# EAGLE schematic Timer_CMD (EAGLE 7.0.0)
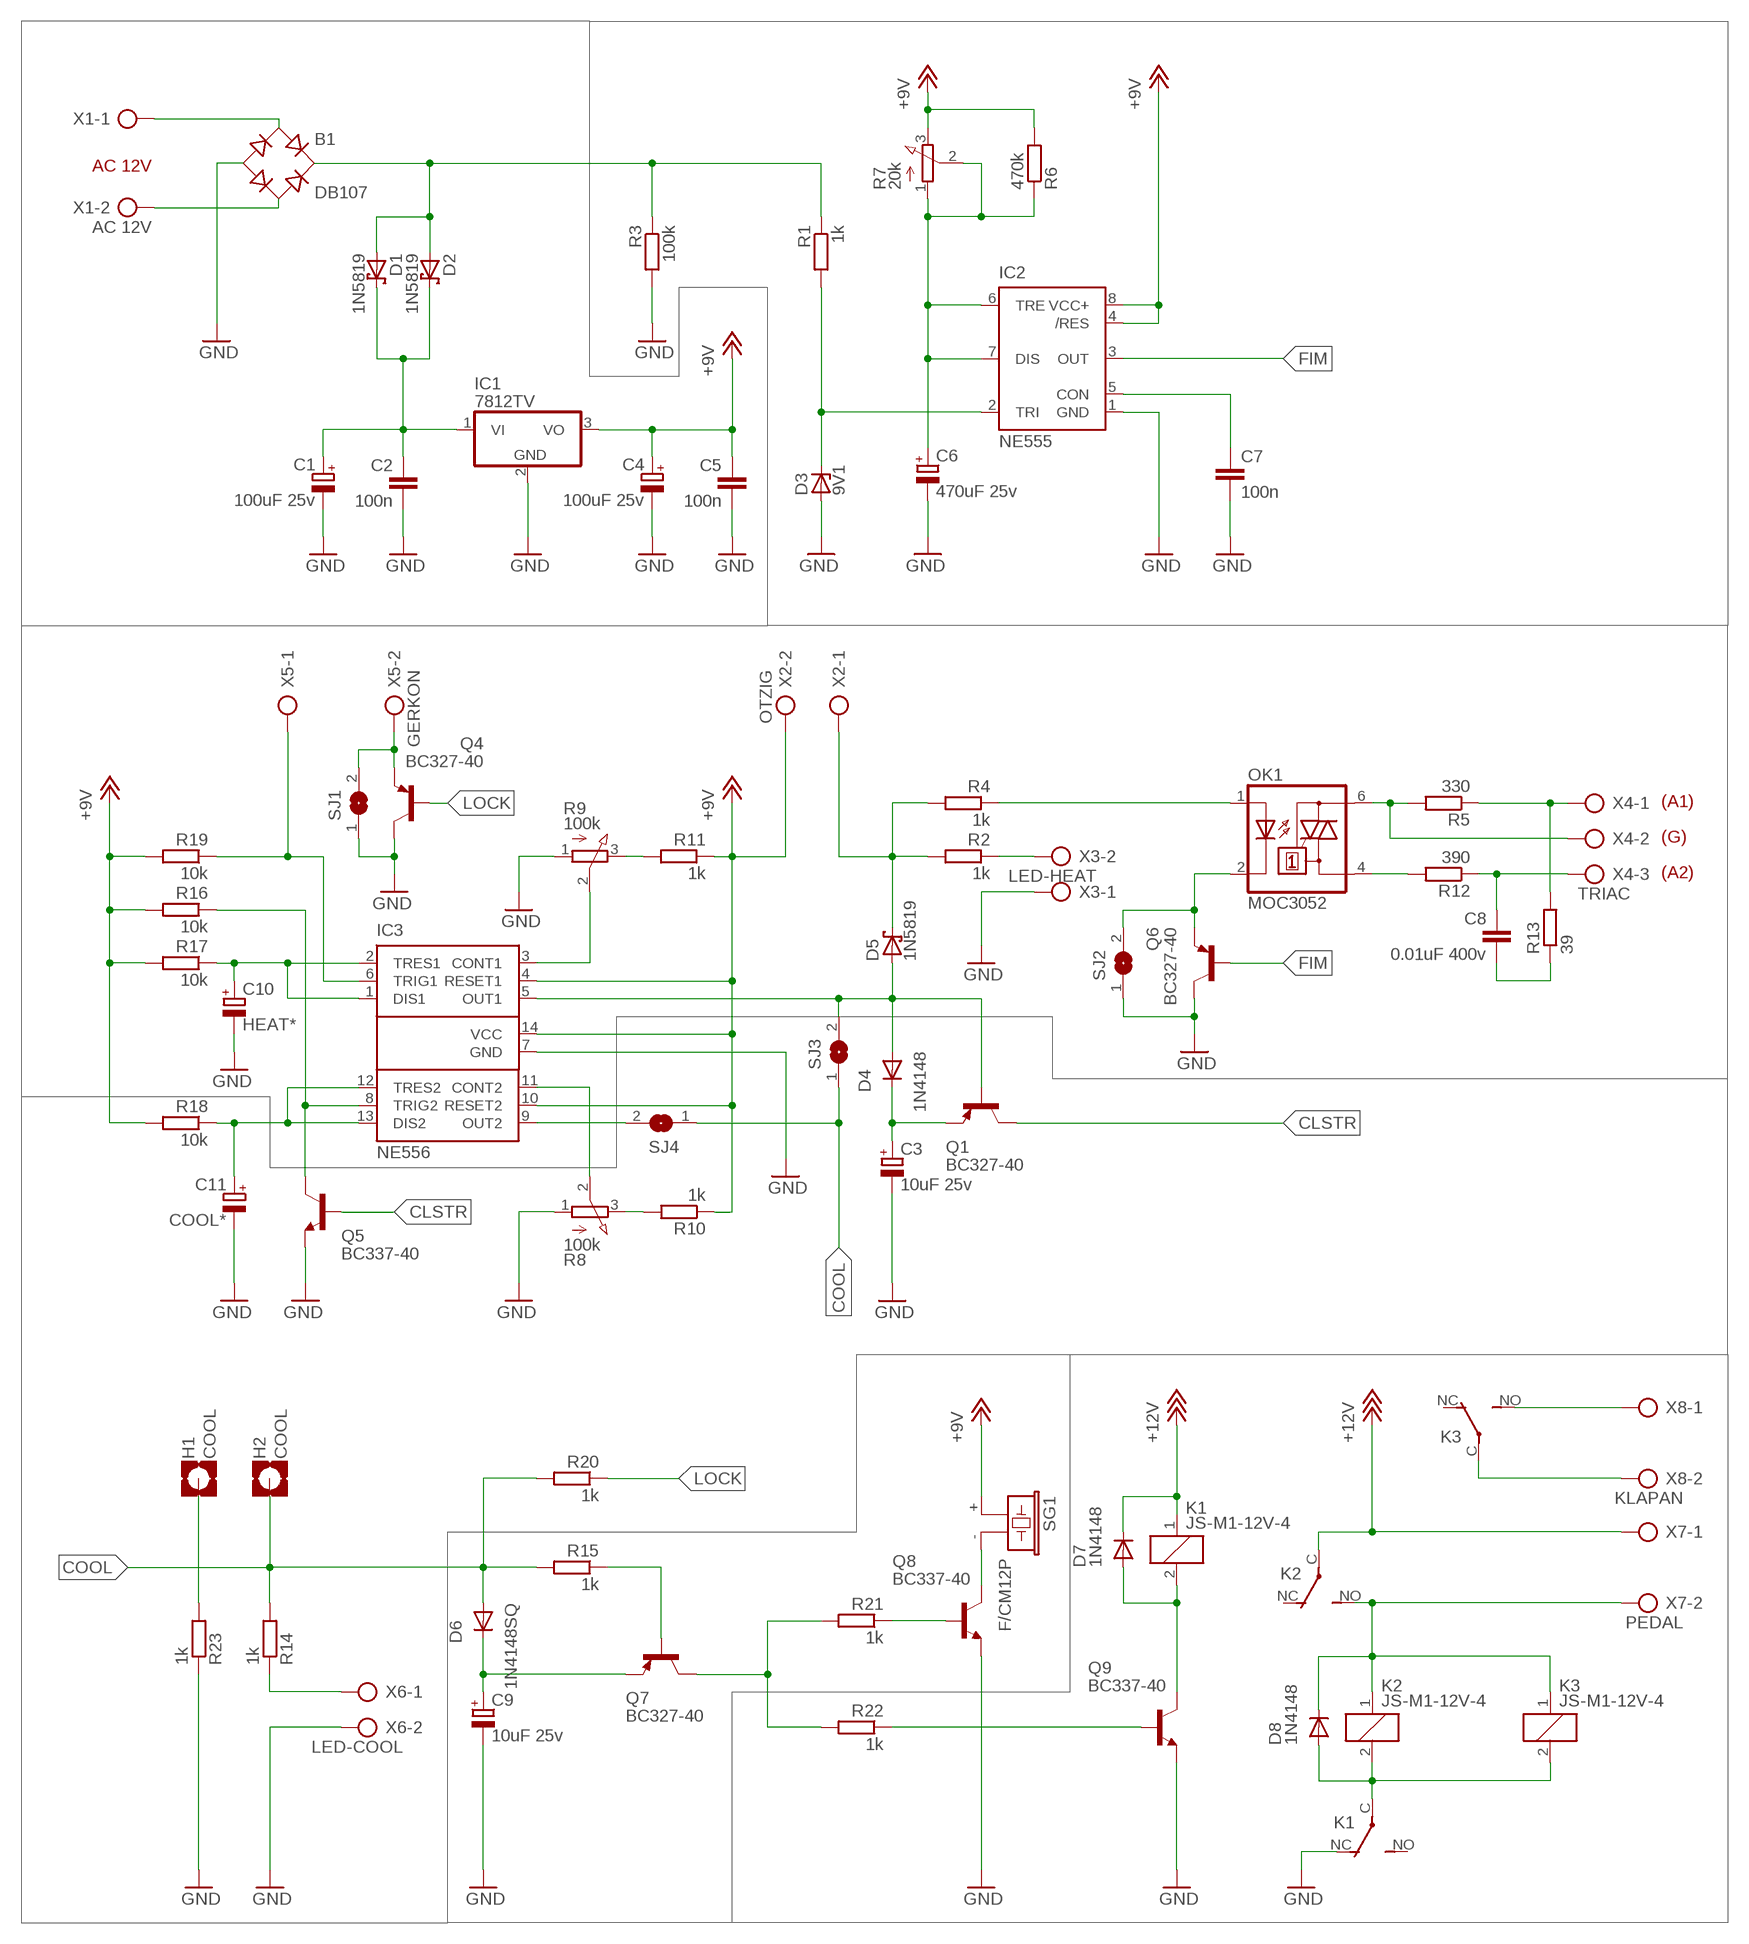
[diagram p0: schematic, sheet 1]

## Parts
B1  DB107  DBDB107G  [DB]
C1  100uF 25v  CPOL-EUE3.5-8  [E3,5-8]
C2  100n  C-EU025-030X050  [C025-030X050]
C3  10uF 25v  CPOL-EUE3.5-8  [E3,5-8]
C4  100uF 25v  CPOL-EUE3.5-8  [E3,5-8]
C5  100n  C-EU025-030X050  [C025-030X050]
C6  470uF 25v  CPOL-EUE3.5-8  [E3,5-8]
C7  100n  C-EU050-035X075  [C050-035X075]
C8  0.01uF 400v  C-EU075-063X106  [C075-063X106]
C9  10uF 25v  CPOL-EUE3.5-8  [E3,5-8]
C10  HEAT*  CPOL-EUE3.5-10  [E3,5-10]
C11  COOL*  CPOL-EUE3.5-10  [E3,5-10]
D1  1N5819  1N5819-T  [DO41-7.6]
D2  1N5819  1N5819-T  [DO41-7.6]
D3  9V1  1N4728  [DO41Z10]
D4  1N4148  1N4148S  [DO35-7SQ]
D5  1N5819  1N5819-T  [DO41-7.6]
D6  1N4148SQ  [DO35-10_SQ]
D7  1N4148  1N4148S  [DO35-7SQ]
D8  1N4148  1N4148S  [DO35-7SQ]
H1  COOL  MOUNT-PAD-SQUARE  [4MM-PAD-SQUARE]
H2  COOL  MOUNT-PAD-SQUARE  [4MM-PAD-SQUARE]
IC1  7812TV  [TO220V]
IC2  NE555  [DIL-08]
IC3  NE556  [DIL14]
K1  JS-M1-12V-4  [JS-M]
K2  JS-M1-12V-4  [JS-M]
K3  JS-M1-12V-4  [JS-M]
OK1  MOC3052  MOC3042M  [DIL06]
Q1  BC327-40  [TO92-EBC]
Q4  BC327-40  [TO92-EBC]
Q5  BC337-40  BC338-40  [TO92-EBC]
Q6  BC327-40  [TO92-EBC]
Q7  BC327-40  [TO92-EBC]
Q8  BC337-40  BC338-40  [TO92-EBC]
Q9  BC337-40  BC338-40  [TO92-EBC]
R1  1k  R-EU_0207/10  [0207/10]
R2  1k  R-EU_0207/10  [0207/10]
R3  100k  R-EU_0207/10  [0207/10]
R4  1k  R-EU_0207/10  [0207/10]
R5  330  R-EU_0207/10  [0207/10]
R6  470k  R-EU_0207/10  [0207/10]
R7  20k  3RP/1610N  [3RP/1610N]
R8  100k  3RP/1610N  [3RP/1610N]
R9  100k  3RP/1610N  [3RP/1610N]
R10  1k  R-EU_0207/10  [0207/10]
R11  1k  R-EU_0207/10  [0207/10]
R12  390  R-EU_0207/10  [0207/10]
R13  39  R-EU_0411/12  [0411/12]
R14  1k  R-EU_0207/10  [0207/10]
R15  1k  R-EU_0207/10  [0207/10]
R16  10k  R-EU_0207/10  [0207/10]
R17  10k  R-EU_0207/10  [0207/10]
R18  10k  R-EU_0207/10  [0207/10]
R19  10k  R-EU_0207/10  [0207/10]
R20  1k  R-EU_0207/10  [0207/10]
R21  1k  R-EU_0207/10  [0207/10]
R22  1k  R-EU_0207/10  [0207/10]
R23  1k  R-EU_0207/10  [0207/10]
SG1  F/CM12P  [F/CM12P]
SJ1  SJ  [SJ]
SJ2  SJ  [SJ]
SJ3  SJ  [SJ]
SJ4  SJ  [SJ]
X1  AC 12V  AK500/2  [AK500/2]
X2  OTZIG  AK500/2  [AK500/2]
X3  LED-HEAT  AK500/2  [AK500/2]
X4  TRIAC  AK500/3  [AK500/3]
X5  GERKON  AK500/2  [AK500/2]
X6  LED-COOL  AK500/2  [AK500/2]
X7  PEDAL  AK500/2  [AK500/2]
X8  KLAPAN  AK500/2  [AK500/2]

## Nets
CLSTR: Q1.C Q5.B
COOL: D6.A H2.B2,8(MOUNT) R14.2 R15.2 R20.2 SJ3.1 SJ4.1
FIM: IC2.3(OUT) Q6.B
GND: B1.- C1.- C2.2 C3.- C4.- C5.2 C6.- C7.2 C9.- C10.- C11.- D3.A IC1.2(GND) IC2.1(GND) IC3.7(GND) K1.NC(2:O) Q4.C Q5.E Q6.C Q8.E Q9.E R3.2 R8.1(A) R9.1(A) R23.1 SJ1.1 SJ2.1 X3.1 X6.2
LOCK: Q4.B R20.1
N$1: B1.+ D1.A D2.A R1.1 R3.1
N$2: C7.1 IC2.5(CON)
N$3: R2.1 X3.2
N$4: C3.+ D4.C Q1.E
N$5: OK1.4(A1) R12.2
N$6: D3.C IC2.2(TRI) R1.2
N$7: D5.C R2.2 R4.2 X2.1
N$8: C8.1 R12.1 X4.3
N$10: C1.+ C2.1 D1.C D2.C IC1.1(VI)
N$11: C10.+ IC3.1(DIS1) IC3.2(TRES1) R17.1
N$12: B1.AC2 X1.2
N$13: B1.AC1 X1.1
N$14: D4.A D5.A IC3.5(OUT1) Q1.B SJ3.2
N$15: OK1.2(C) Q6.E SJ2.2
N$17: C4.+ C5.1 IC1.3(VO) IC2.4(/RES) IC2.8(VCC+) IC3.4(RESET1) IC3.10(RESET2) IC3.14(VCC) R6.2 R7.3(E) R10.1 R11.1 R16.2 R17.2 R18.2 R19.2 SG1.+ X2.2 ; supply symbol labelled +9V
N$18: R5.1 R13.2 X4.1
N$19: C8.2 R13.1
N$20: Q7.B R15.1
N$22: Q7.C R21.2 R22.2
N$23: D7.A K1.2 Q9.C
N$24: Q8.B R21.1
N$25: C11.+ IC3.12(TRES2) IC3.13(DIS2) R18.1
N$27: D7.C K1.1 K2.C(2:P) X7.1 ; supply symbol labelled +12V
N$28: IC3.3(CONT1) R9.2(S)
N$29: R9.3(E) R11.2
N$30: IC3.11(CONT2) R8.2(S)
N$31: Q4.E SJ1.2 X5.2
N$32: R8.3(E) R10.2
N$33: IC3.6(TRIG1) R19.1 X5.1
N$34: C9.+ D6.C Q7.E
N$35: Q9.B R22.1
N$36: D8.C K2.1 K2.NO(2:S) K3.1 X7.2
N$37: Q8.C SG1.-
N$38: OK1.6(A2) R5.2 X4.2
N$40: D8.A K1.C(2:P) K2.2 K3.2
N$41: K3.NO(2:S) X8.1
N$42: R14.1 X6.1
N$43: H1.B2,8(MOUNT) R23.2
N$53: IC3.9(OUT2) SJ4.2
N$64: C6.+ IC2.6(TRE) IC2.7(DIS) R6.1 R7.1(A) R7.2(S)
N$65: OK1.1(A) R4.1
N$66: IC3.8(TRIG2) Q5.C R16.1
N$68: K3.C(2:P) X8.2
Unconnected: K1.NO(2:S) K2.NC(2:O) K3.NC(2:O)

## Notes on the sheet
- AC 12V
- (A1)
- (G)
- (A2)

## Library data of the parts
B1 = rectifier:DB?*G: Single Phase 1.0 AMP Glass Passivated Bridge Rectifier Taiwan Semiconductor Co.,Ltd. - TSC Source: http://www.taiwansemi.com/TSCbig5/ezcatfiles/cust/img/img/db101g.pdf http://www.ts.com.tw/db/pictures/modules/PDT/PDT060207001/DBLS201G.pdf
C1 C3 C4 C6 C9-C11 = rcl:CPOL-EU: POLARIZED CAPACITOR, European symbol
C2 C5 C7 C8 = rcl:C-EU: CAPACITOR, European symbol
D1 D2 D5 = diode:1N581*: 1.0A SCHOTTKY BARRIER RECTIFIER Source: http://www.diodes.com/datasheets/ds23001.pdf
D3 = diode:1N4728: Z DIODE 3.3 V, 1W, 5 percent
D4 D6-D8 = diode:1N4148: DIODE high speed (Philips)
H1 H2 = holes:MOUNT-PAD-SQUARE: MOUNTING PAD, square
IC1 = linear:78*: Positive VOLTAGE REGULATOR Source: http://cache.national.com/ds/LM/LM78L05.pdf http://www.fairchildsemi.com/ds/LM/LM7805.pdf
IC2 = st-microelectronics:NE555: General purpose bipolar Timer; MF: Arrow Electronics; MPN: NE555N; OC_FARNELL: 1467742; OC_NEWARK: 89K1486
IC3 = st-microelectronics:NE556: General Purpose Biopolartimer; MPN: NE556; OC_FARNELL: 2349784; OC_NEWARK: 83C0108
K1-K3 = relay:JS-M1*: Automotive Ultra-Miniature Power Relay NAiS Source: http://www.mew-europe.com/.. en_ds_61211_0000.pdf; MPN: JSM1-12V-4; OC_FARNELL: 910338; OC_NEWARK: 13P4552
OK1 = optocoupler:MOC30*: 6-Pin DIP Zero-Cross Optoisolators Triac Driver Output (250/400 Volt Peak) Source: Data sheet <http://www.fairchildsemi.com/ds/MO/MOC3031M.pdf> The old path of data sheet not more available 2013-05-06.; MF: FAIRCHILD SEMICONDUCTOR; MPN: MOC3042-M; OC_FARNELL: 1021368; OC_NEWARK: 72K8899
Q1 Q4 Q6 Q7 = transistor-pnp:BC327*: PNP Transistror
Q5 Q8 Q9 = transistor-npn:BC338*: NPN Transistor
R1-R6 R10-R23 = rcl:R-EU_: RESISTOR, European symbol
R7-R9 = pot:3RP/1610N: 16mm Potentiometer one level Source: http://www.alphapotentiometers.net/html/16mm_pot_2.html
SG1 = buzzer:F/CM12P: BUZZER Source: Buerklin; OC_FARNELL: unknown; OC_NEWARK: unknown
SJ1-SJ4 = jumper:SJ: SMD solder JUMPER
X1-X3 X5-X8 = con-ptr500:AK500/2: CONNECTOR; OC_FARNELL: unknown; OC_NEWARK: unknown
X4 = con-ptr500:AK500/3: CONNECTOR; OC_FARNELL: unknown; OC_NEWARK: unknown